# Altium project tabdil motor.PrjPcb
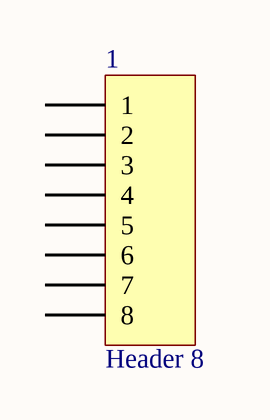
[diagram p0: tabdil motor.SchDoc]
1 sheet, 1 parts. Net scope: global (net labels, ports and power ports of the same name join across sheets).
Board file: tabdil motor.PcbDoc

## Sheet tabdil motor.SchDoc
size A

### Parts
1  Header 8  [tabdil motor]

### Nets

Not connected (* = marked no-connect by the designer): 1 1 2 3 4 5 6 7 8

### Library data of the parts
1 = Header 8: Header, 8-Pin; LatestRevisionDate: 17-Jul-2002; LatestRevisionNote: Re-released for DXP Platform.; Publisher: Altium Limited